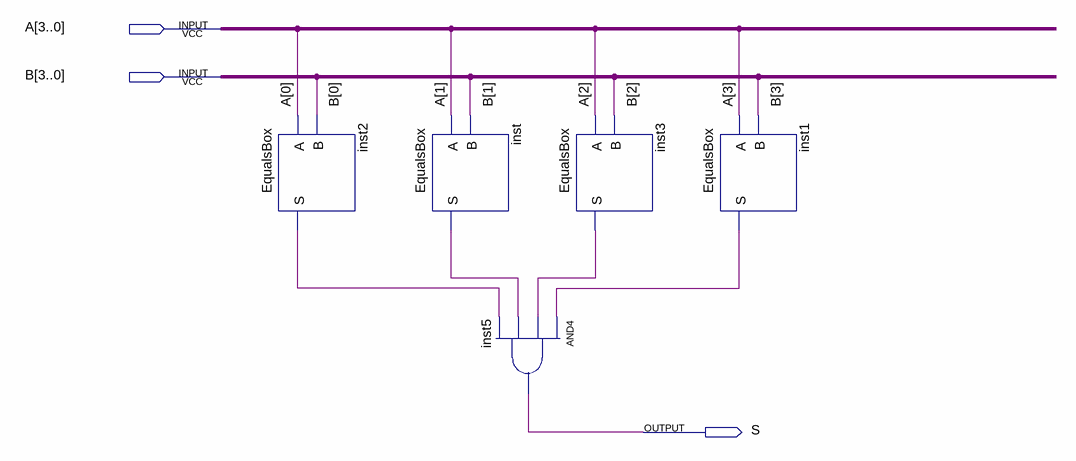
[diagram p0: schematic sheet]
// Quartus schematic EqualsSystem.bdf as structural Verilog: 5 symbols, 3 pins
module EqualsSystem (
  input  [3:0] A,
  input  [3:0] B,
  output S
);

  wire inst1_s, inst2_s, inst3_s, inst_s;

  EqualsBox inst2 (.A(A[0]), .B(B[0]), .S(inst2_s));
  EqualsBox inst (.A(A[1]), .B(B[1]), .S(inst_s));
  and inst5 (S, inst1_s, inst3_s, inst_s, inst2_s);
  EqualsBox inst3 (.A(A[2]), .B(B[2]), .S(inst3_s));
  EqualsBox inst1 (.A(A[3]), .B(B[3]), .S(inst1_s));
endmodule
